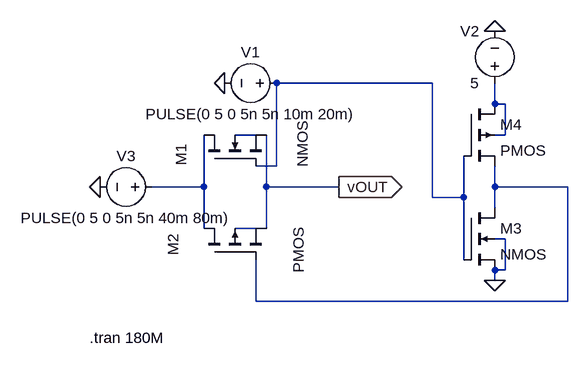
[diagram p0: schematic transmission_gate.asc]
transmission_gate.asc, the LTspice schematic file:
Version 4
SHEET 1 928 680
WIRE 448 -32 208 -32
WIRE 544 0 544 -32
WIRE 560 0 544 0
WIRE 176 48 144 48
WIRE 560 48 560 0
WIRE 560 48 544 48
WIRE 208 96 208 -32
WIRE 208 96 176 96
WIRE 96 128 96 48
WIRE 96 128 16 128
WIRE 192 128 192 48
WIRE 304 128 192 128
WIRE 544 128 544 96
WIRE 656 128 544 128
WIRE 448 144 448 -32
WIRE 496 144 496 80
WIRE 496 144 448 144
WIRE 544 160 544 128
WIRE 96 192 96 128
WIRE 176 192 144 192
WIRE 192 192 192 128
WIRE 560 208 544 208
WIRE 496 240 496 144
WIRE 560 256 560 208
WIRE 560 256 544 256
WIRE 544 272 544 256
WIRE 176 304 176 240
WIRE 656 304 656 128
WIRE 656 304 176 304
FLAG 128 -32 0
FLAG -64 128 0
FLAG 304 128 vOUT
IOPIN 304 128 Out
FLAG 544 272 0
FLAG 544 -112 0
SYMBOL nmos4 96 96 R270
WINDOW 0 0 -35 Left 2
WINDOW 3 -2 152 Left 2
SYMATTR InstName M1
SYMBOL pmos4 96 240 R270
WINDOW 0 6 -47 Left 2
WINDOW 3 -21 146 Left 2
SYMATTR InstName M2
SYMBOL voltage 224 -32 R90
WINDOW 0 -32 56 VBottom 2
WINDOW 3 32 56 VTop 2
WINDOW 123 0 0 Left 0
WINDOW 39 0 0 Left 0
SYMATTR InstName V1
SYMATTR Value PULSE(0 5 0 5n 5n 10m 20m)
SYMBOL voltage 32 128 R90
WINDOW 0 -32 56 VBottom 2
WINDOW 3 32 56 VTop 2
WINDOW 123 0 0 Left 0
WINDOW 39 0 0 Left 0
SYMATTR InstName V3
SYMATTR Value PULSE(0 5 0 5n 5n 40m 80m)
SYMBOL nmos4 496 160 R0
SYMATTR InstName M3
SYMBOL pmos4 496 0 R0
SYMATTR InstName M4
SYMBOL voltage 544 -16 R180
WINDOW 0 24 96 Left 2
WINDOW 3 24 16 Left 2
WINDOW 123 0 0 Left 0
WINDOW 39 0 0 Left 0
SYMATTR InstName V2
SYMATTR Value 5
TEXT -80 360 Left 2 !.tran 180M

The netlist it stands for:
* transmission_gate.asc
M1 N004 N001 vOUT N003 NMOS
M2 N004 N005 vOUT N006 PMOS
V1 N001 0 PULSE(0 5 0 5n 5n 10m 20m)
V3 N004 0 PULSE(0 5 0 5n 5n 40m 80m)
M3 N005 N001 0 0 NMOS
M4 N002 N001 N005 N002 PMOS
V2 N002 0 5
.model NMOS NMOS
.model PMOS PMOS
.lib standard.mos
.tran 180M
.backanno
.end